# EAGLE design T STorM32 motor v251E-jst (EAGLE 7.5.0)
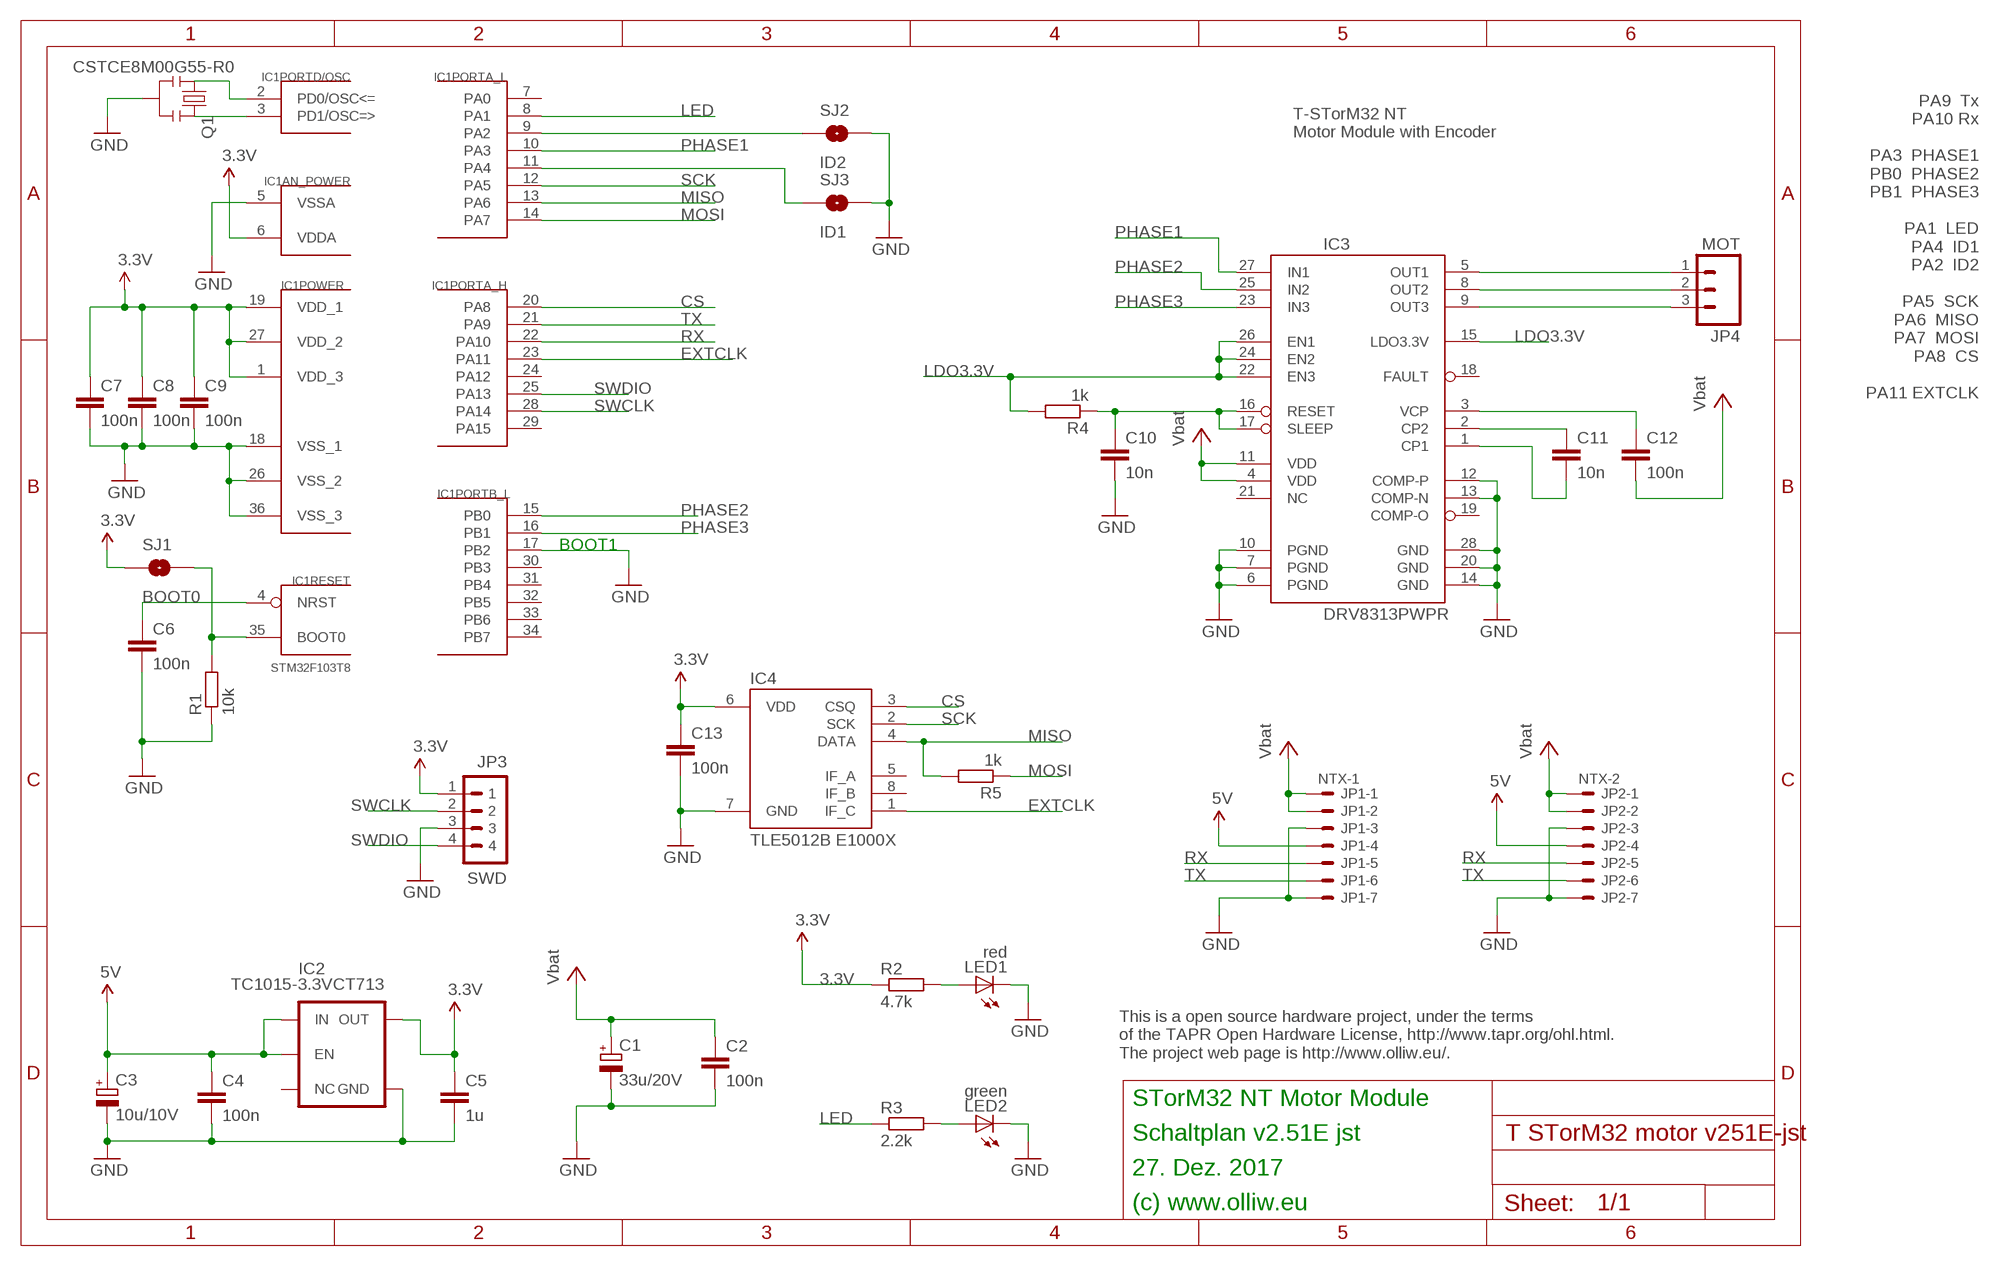
[diagram p0: schematic, sheet 1]

## Parts
C1  33u/20V  CPOL-EUSMCC  [SMC_C]
C2  100n  C-EUC0603  [C0603]
C3  10u/10V  CPOL-EUSMCB  [SMC_B]
C4  100n  C-EUC0603  [C0603]
C5  1u  C-EUC0603  [C0603]
C6  100n  C-EUC0603  [C0603]
C7  100n  C-EUC0603  [C0603]
C8  100n  C-EUC0603  [C0603]
C9  100n  C-EUC0603  [C0603]
C10  10n  C-EUC0603  [C0603]
C11  10n  C-EUC0603  [C0603]
C12  100n  C-EUC0603  [C0603]
C13  100n  C-EUC0603  [C0603]
IC1  STM32F103T8  STM32F10XTXU6  [VFQFPN36]
IC2  TC1015-3.3VCT713  V_REG_TPS76433SOT23-5  [SOT23-5]
IC3  DRV8313PWPR  DRV8313  [HTSSOP28]
IC4  TLE5012B E1000X  TLE5012B  [SO08]
JP1  NTX-1  SM07B-SRSS-TB  [SM07B-SRSS-TB]
JP2  NTX-2  SM07B-SRSS-TB  [SM07B-SRSS-TB]
JP3  SWD  P4X1_1P27-OCT_BILEX  [4X1_1P27_OCT_BILEX]
JP4  MOT  M03PTH  [1X03]
LED1  red  LEDCHIPLED_0603  [CHIPLED_0603]
LED2  green  LEDCHIPLED_0603  [CHIPLED_0603]
Q1  CSTCE8M00G55-R0  RESONATORSMD  [RESONATOR-SMD]
R1  10k  R-EU_R0603  [R0603]
R2  4.7k  R-EU_R0603  [R0603]
R3  2.2k  R-EU_R0603  [R0603]
R4  1k  R-EU_R0603  [R0603]
R5  1k  R-EU_R0603  [R0603]
SJ1  BOOT0  SOLDERJUMPERNO  [SJ_2S-NO]
SJ2  ID2  SOLDERJUMPERNO  [SJ_2S-NO]
SJ3  ID1  SOLDERJUMPERNO  [SJ_2S-NO]

## Nets
3.3V: C5.1 C7.1 C8.1 C9.1 C13.1 IC1.1(POWER:VDD_3) IC1.6(AN_POWER:VDDA) IC1.19(POWER:VDD_1) IC1.27(POWER:VDD_2) IC2.5(OUT) IC4.6(VDD) JP3.1 R2.1 SJ1.1
5V: C3.+ C4.1 IC2.1(IN) IC2.3(EN) JP1.4 JP2.4
CS: IC1.20(PORTA_H:PA8) IC4.3(CSQ)
EXTCLK: IC1.23(PORTA_H:PA11) IC4.1(IF_C)
GND: C1.- C2.2 C3.- C4.2 C5.2 C6.2 C7.2 C8.2 C9.2 C10.2 C13.2 IC1.5(AN_POWER:VSSA) IC1.17(PORTB_L:PB2) IC1.18(POWER:VSS_1) IC1.26(POWER:VSS_2) IC1.36(POWER:VSS_3) IC2.2(GND) IC3.6(PGND) IC3.7(PGND) IC3.10(PGND) IC3.12(COMP-P) IC3.13(COMP-N) IC3.14(GND) IC3.20(GND) IC3.28(GND) IC4.7(GND) JP1.3 JP1.7 JP2.3 JP2.7 JP3.3 LED1.C LED2.C Q1.2 R1.1 SJ2.2 SJ3.2
LDO3.3V: IC3.15(LDO3.3V) IC3.22(EN3) IC3.24(EN2) IC3.26(EN1) R4.2
LED: IC1.8(PORTA_L:PA1) R3.1
MISO: IC1.13(PORTA_L:PA6) IC4.4(DATA) R5.2
MOSI: IC1.14(PORTA_L:PA7) R5.1
N$2: IC3.9(OUT3) JP4.3
N$3: IC1.9(PORTA_L:PA2) SJ2.1
N$4: IC1.11(PORTA_L:PA4) SJ3.1
N$7: C6.1 IC1.4(RESET:NRST)
N$8: IC1.35(RESET:BOOT0) R1.2 SJ1.2
N$9: IC1.2(PORTD/OSC:PD0/OSC<=) Q1.1
N$10: IC1.3(PORTD/OSC:PD1/OSC=>) Q1.3
N$11: LED1.A R2.2
N$12: LED2.A R3.2
N$14: IC3.8(OUT2) JP4.2
N$15: IC3.5(OUT1) JP4.1
N$16: C11.1 IC3.2(CP2)
N$18: C11.2 IC3.1(CP1)
N$19: C10.1 IC3.16(RESET) IC3.17(SLEEP) R4.1
N$20: C12.1 IC3.3(VCP)
PHASE1: IC1.10(PORTA_L:PA3) IC3.27(IN1)
PHASE2: IC1.15(PORTB_L:PB0) IC3.25(IN2)
PHASE3: IC1.16(PORTB_L:PB1) IC3.23(IN3)
RX: IC1.22(PORTA_H:PA10) JP1.5 JP2.5
SCK: IC1.12(PORTA_L:PA5) IC4.2(SCK)
SWCLK: IC1.28(PORTA_H:PA14) JP3.2
SWDIO: IC1.25(PORTA_H:PA13) JP3.4
TX: IC1.21(PORTA_H:PA9) JP1.6 JP2.6
VCC: C1.+ C2.1 C12.2 IC3.4(VDD) IC3.11(VDD) JP1.1 JP1.2 JP2.1 JP2.2 ; supply symbol labelled Vbat
Unconnected: IC1.7(PORTA_L:PA0) IC1.24(PORTA_H:PA12) IC1.29(PORTA_H:PA15) IC1.30(PORTB_L:PB3) IC1.31(PORTB_L:PB4) IC1.32(PORTB_L:PB5) IC1.33(PORTB_L:PB6) IC1.34(PORTB_L:PB7) IC2.4(NC) IC3.18(FAULT) IC3.19(COMP-O) IC3.21(NC) IC4.5(IF_A) IC4.8(IF_B)

## Notes on the sheet
- PA9  Tx
  PA10 Rx
  
  PA3  PHASE1
  PB0  PHASE2
  PB1  PHASE3
  
  PA1  LED
  PA4  ID1
  PA2  ID2
  
  PA5  SCK
  PA6  MISO
  PA7  MOSI
  PA8  CS
  
  PA11 EXTCLK
- T-STorM32 NT
  Motor Module with Encoder
- BOOT1
- This is a open source hardware project, under the terms
  of the TAPR Open Hardware License, http://www.tapr.org/ohl.html.
  The project web page is http://www.olliw.eu/.
- STorM32 NT Motor Module
- Schaltplan v2.51E jst
- 27. Dez. 2017
- (c) www.olliw.eu

## Library data of the parts
C1 C3 = rcl:CPOL-EU: POLARIZED CAPACITOR, European symbol
C2 C4-C13 = rcl:C-EU: CAPACITOR, European symbol
IC1 = # stm32:STM32F10XTXU6: STM32F101/103 36pad VFQPFN36
IC2 = # SparkFun2:V_REG_TPS76433: Voltage Regulator Older TI part. LDO 150mA regulator. No output by-pass cap option. See V_REG_LDO for a better part.
IC3 = # stdlib:DRV8313
IC4 = # stdlib:TLE5012B
JP1 JP2 = con-jst2:?M07B-SRSS-TB: Disconnectable Crimp style connector, 1.0mm pitch 7 contacts
JP3 = # stdlib:P4X1_1P27
JP4 = # SparkFun:M03: Header 3 Standard 3-pin 0.1" header. Use with straight break away headers (SKU : PRT-00116), right angle break away headers (PRT-00553), swiss pins (PRT-00743), machine pins (PRT-00117), and female headers (PRT-00115). Molex polarized connector foot print use with SKU : PRT-08232 with associated crimp pins and housings.
LED1 LED2 = led:LED: LED OSRAM: - CHIPLED LG R971, LG N971, LY N971, LG Q971, LY Q971, LO R971, LY R971 LH N974, LH R974 LS Q976, LO Q976, LY Q976 LO Q996 - Hyper CHIPLED LW Q18S LB Q993, LB Q99A, LB R99A - SideLED LS A670, LO A670, LY A670, LG A670, LP A670 LB A673, LV A673, LT A673, LW A673 LH A674 LY A675 LS A676, LA A676, LO A676, LY A676, LW A676 LS A679, LY A679, LG A679 - Hyper Micro SIDELED® LS Y876, LA Y876, LO Y876, LY Y876 LT Y87S - SmartLED LW L88C, LW L88S LB L89C, LB L89S, LG L890 LS L89K, LO L89K, LY L89K LS L896, LA L896, LO L896, LY L896 - TOPLED LS T670, LO T670, LY T670, LG T670, LP T670 LSG T670, LSP T670, LSY T670, LOP T670, LYG T670 LG T671, LOG T671, LSG T671 LB T673, LV T673, LT T673, LW T673 LH T674 LS T676, LA T676, LO T676, LY T676, LB T676, LH T676, LSB T676, LW T676 LB T67C, LV T67C, LT T67C, LS T67K, LO T67K, LY T67K, LW E67C LS E67B, LA E67B, LO E67B, LY E67B, LB E67C, LV E67C, LT E67C LW T67C LS T679, LY T679, LG T679 LS T770, LO T770, LY T770, LG T770, LP T770 LB T773, LV T773, LT T773, LW T773 LH T774 LS E675, LA E675, LY E675, LS T675 LS T776, LA T776, LO T776, LY T776, LB T776 LHGB T686 LT T68C, LB T68C - Hyper Mini TOPLED® LB M676 - Mini TOPLED Santana® LG M470 LS M47K, LO M47K, LY M47K Source: http://www.osram.convergy.de LUXEON: - LUMILED® LXK2-PW12-R00, LXK2-PW12-S00, LXK2-PW14-U00, LXK2-PW14-V00 LXK2-PM12-R00, LXK2-PM12-S00, LXK2-PM14-U00 LXK2-PE12-Q00, LXK2-PE12-R00, LXK2-PE12-S00, LXK2-PE14-T00, LXK2-PE14-U00 LXK2-PB12-K00, LXK2-PB12-L00, LXK2-PB12-M00, LXK2-PB14-N00, LXK2-PB14-P00, LXK2-PB14-Q00 LXK2-PR12-L00, LXK2-PR12-M00, LXK2-PR14-Q00, LXK2-PR14-R00 LXK2-PD12-Q00, LXK2-PD12-R00, LXK2-PD12-S00 LXK2-PH12-R00, LXK2-PH12-S00 LXK2-PL12-P00, LXK2-PL12-Q00, LXK2-PL12-R00 Source: www.luxeon.com KINGBRIGHT: KA-3528ASYC Source: www.kingbright.com
Q1 = # SparkFun2:RESONATOR: Resonator Small SMD resonator. This is the itty bitty 10/20MHz resonators with built in caps. CSTCE10M0G55 and CSTCE20M0V53. Footprint has been reviewed closely but hasn't been tested yet.
R1-R5 = rcl:R-EU_: RESISTOR, European symbol
SJ1-SJ3 = # SparkFun2:SOLDERJUMPER: Solder Jumper Standard SMD solder jumper. Used to automate production. Two varients : Normally Open and Normally Closed are the same, but have different paste layers. NC will have a large amount of paste and should jumper during reflow.

## Board
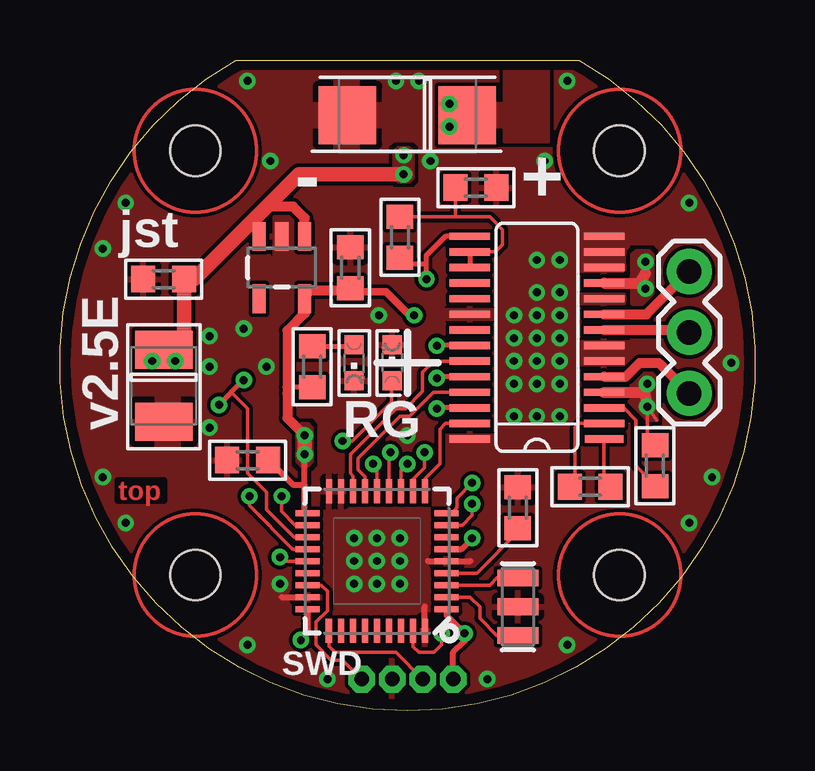
[diagram p1: board, top side]
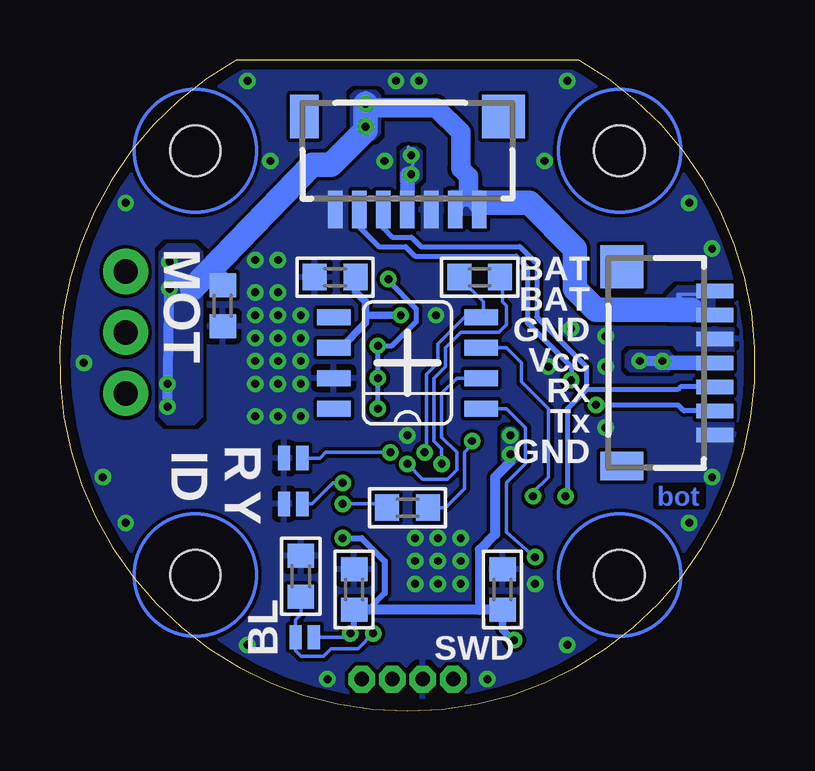
[diagram p2: board, bottom side, seen from below]

Size 28.97 x 27.12 mm. Coordinates in mm from the lower left corner, seen from the top.
Outline: 7.34,27.12 21.63,27.12 arc-301 7.34,27.12
Copper layers (1*16): Top 0.0356mm / dielectric 1.5011mm / Bottom 0.0356mm
Design rules "ow-oshpark-2layer": minimum track width 6mil, minimum drill 13mil, track to track 6mil, track to pad 6mil, pad to pad 6mil, via to via 6mil, smd to smd 6mil, copper to edge 15mil, drill to drill 6mil, minimum pad ring 7mil, minimum via ring 7mil, stop-mask expansion 2.5mil, vias tented up to drill 26mil, thermal gap 10mil
Holes 2.1 mm at 5.65,23.34 23.33,23.34 23.33,5.66 5.65,5.66

### Footprints (pad centres in the part's own frame; a part is rotated, then mirrored left to right if it is on the bottom)
SMC_C = smd 2.4 x 2.4: + -2.5,0; - 2.5,0
C0603 = smd 1 x 1.1: 1 -0.85,0; 2 0.85,0
SMC_B = smd 1.6 x 2.4: + -1.5,0; - 1.5,0
VFQFPN36 = smd 1 x 0.25: 1 -2.9,2; 2 -2.9,1.5; 3 -2.9,1; 4 -2.9,0.5; 5 -2.9,0; 6 -2.9,-0.5; 7 -2.9,-1; 8 -2.9,-1.5; 9 -2.9,-2; 19 2.9,-2; 20 2.9,-1.5; 21 2.9,-1; 22 2.9,-0.5; 23 2.9,0; 24 2.9,0.5; 25 2.9,1; 26 2.9,1.5; 27 2.9,2 | smd 0.25 x 1: 10 -2,-2.9; 11 -1.5,-2.9; 12 -1,-2.9; 13 -0.5,-2.9; 14 0,-2.9; 15 0.5,-2.9; 16 1,-2.9; 17 1.5,-2.9; 18 2,-2.9; 29 1.5,2.9; 30 1,2.9; 31 0.5,2.9; 32 0,2.9; 33 -0.5,2.9; 34 -1,2.9; 35 -1.5,2.9; 36 -2,2.9 | smd 0.27 x 1: 28 2,2.9
SOT23-5 = smd 0.55 x 1.2: 1 -0.95,-1.3; 2 0,-1.3; 3 0.95,-1.3; 4 0.95,1.3; 5 -0.95,1.3
HTSSOP28 = smd 0.3 x 1.6: 1 0,-2.8 | smd 0.305 x 1.676: 2 0.65,-2.8; 3 1.3,-2.8; 4 1.95,-2.8; 5 2.6,-2.8; 6 3.25,-2.8; 7 3.9,-2.8; 8 4.55,-2.8; 9 5.2,-2.8; 10 5.85,-2.8; 11 6.5,-2.8; 12 7.15,-2.8; 13 7.8,-2.8; 14 8.45,-2.8; 15 8.45,2.8; 16 7.8,2.8; 17 7.15,2.8; 18 6.5,2.8; 19 5.85,2.8; 20 5.2,2.8; 21 4.55,2.8; 22 3.9,2.8; 23 3.25,2.8; 24 2.6,2.8; 25 1.95,2.8; 26 1.3,2.8; 27 0.65,2.8; 28 0,2.8
SO08 = smd 0.66 x 1.397: 1 0,-3.073; 2 1.27,-3.073; 3 2.54,-3.073; 4 3.81,-3.073; 5 3.81,3.073; 6 2.54,3.073; 7 1.27,3.073; 8 0,3.073
SM07B-SRSS-TB = smd 0.6 x 1.55: 1 -3,2.975; 2 -2,2.975; 3 -1,2.975; 4 0,2.975; 5 1,2.975; 6 2,2.975; 7 3,2.975 | smd 1.8 x 1.8: FIT@1 -4,-0.9 | smd 1.2 x 1.8: FIT@2 4.3,-0.9
4X1_1P27_OCT_BILEX = drill 0.61 pad 1.118 octagon: 1 0,0; 2 0,-1.27; 3 0,-2.54; 4 0,-3.81
1X03 = drill 1.016 pad 1.88: 1 0,0; 2 2.54,0; 3 5.08,0
CHIPLED_0603 = smd 0.8 x 0.8: A 0,-0.75; C 0,0.75
RESONATOR-SMD = smd 0.7 x 1.7: 1 -1.2,0; 2 0,0; 3 1.2,0
R0603 = smd 1 x 1.1: 1 -0.85,0; 2 0.85,0
SJ_2S-NO = smd 0.508 x 1.016: 1 -0.381,0; 2 0.381,0

### Placement (x,y rotation side)
C1  14.49,24.82 180 top
C2  22.19,16.88 270 bottom
C3  4.33,13.55 270 top
C4  4.33,17.99 180 top
C5  12.11,18.47 90 top
C6  19.09,8.47 90 top
C7  10.52,5.06 90 bottom
C8  7.82,10.45 180 top
C9  16.71,5.06 90 bottom
C10  17.34,21.8 0 top
C11  22.11,9.34 0 top
C12  24.81,10.22 90 top
C13  17.5,18.07 180 bottom
IC1  13.22,6.25 180 top
IC2  9.25,18.47 180 top
IC3  19.88,11.33 90 top
IC4  14.49,12.6 90 bottom
JP1  4.64,14.5 270 bottom
JP2  14.49,23.87 180 bottom
JP3  16.39,1.33 270 top
JP4  26.23,13.23 90 top
LED1  12.26,14.5 180 top
LED2  13.85,14.5 0 top
Q1  19.09,4.34 90 top
R1  18.93,5.61 270 bottom
R2  10.52,14.34 90 top
R3  14.49,8.47 0 bottom
R4  14.17,19.74 270 top
R5  11.47,18.07 180 bottom
SJ1  18.77,3.07 180 bottom
SJ2  19.25,8.63 180 bottom
SJ3  19.25,10.53 180 bottom

### Tracks (layer width: path | path; a pad name or v marks a point on that pad's centre or on a via)
3.3V  (via drill 0.33)
  Top 0.152: IC1.19 10.2,8.25 | 9.38,13.49 9.49,13.23 | C5.1 12.53,17.46 | C8.1 8.51,10.32
  Top 0.203: R2.1 9.38,13.49
  Top 0.254: IC1.27 10.32,3.23 v10.04,2.95 | 10.2,8.25 10.2,9.42 | 10.2,9.42 10.2,10.45 | IC1.6 16.73,6.75 v17.19,7.2 | JP3.1 16.39,2.44 16.87,2.91 v16.87,3.23 16.12,3.98 IC1.1 | C8.1 8.85,10.3 9.72,9.42 10.2,9.42
  Top 0.305: 10.2,10.45 v10.2,10.69 | 12.53,17.46 13.59,17.46 14.57,16.49 v14.77,16.49 | 12.42,17.52 12.37,17.52 C5.1
  Top 0.406: v10.2,11.49 9.49,12.2 9.49,13.23 9.49,15.85 10.2,16.56 IC2.5 10.36,17.52 12.42,17.52
  Top 0.61: v10.2,11.49 v10.2,10.69
  Bottom 0.152: 16.08,4.26 16.71,4.13 | IC4.6 17.27,15.14 | v16.87,3.23 17.03,3.07 SJ1.1
  Bottom 0.254: v17.19,7.2 16.39,7.2 15.44,6.25 15.44,4.9 16.08,4.26 | v16.87,3.23 16.71,3.39 16.71,4.13 C9.1
  Bottom 0.305: v10.04,2.95 10.08,2.95 10.52,3.39 C7.1 | 17.27,15.14 16.23,16.17 16.23,16.57 | v14.77,16.49 16.15,16.49 16.23,16.57 | C13.1 16.65,17.46 16.23,17.04 16.23,16.57
  Bottom 0.406: C7.1 11.47,4.21 | 11.47,4.21 C9.1 | v10.2,10.69 10.2,10.38 10.84,9.74 10.84,7.36 11.47,6.72 11.47,4.21
  pour Top: 9.88,11.8 10.04,11.96 10.36,11.96 10.52,11.8 10.52,10.37 10.36,10.22 10.04,10.22 9.88,10.37
  pour Bottom: 9.88,11.64 10.04,11.8 10.36,11.8 10.52,11.64 10.52,10.45 10.36,10.3 10.04,10.3 9.88,10.45
5V  (via drill 0.33)
  Top 0.152: v14.33,22.36 14.41,22.36 | 4.17,15.53 v3.85,14.58 | IC2.3 8.46,20.06 8.06,20.46
  Top 0.406: IC2.1 10.2,20.54 9.72,21.01 8.61,21.01 | C3.+ 4.02,14.58 v3.85,14.58
  Top 0.61: 14.41,22.36 9.96,22.36 8.61,21.01 8.06,20.46 5.6,18 C4.1 5.18,15.59 v3.85,14.58
  Bottom 0.152: 4.28,14.55 v3.85,14.58 | v14.33,22.36 14.22,23.19 14.44,23.5 v14.33,23.15
  Bottom 0.203: 3.93,14.66 v3.85,14.58 3.93,14.5 | 14.49,22.36 v14.33,22.36
  Bottom 0.406: v4.8,14.58 v3.85,14.58
  Bottom 0.61: JP1.4 3.93,14.5 | JP2.4 14.49,22.36
  pour Bottom: 3.45,14.82 3.61,14.98 5.2,14.98 5.36,14.82 5.36,14.34 5.2,14.18 3.61,14.18 3.45,14.34
  pour Bottom: 13.93,23.31 14.09,23.47 14.57,23.47 14.73,23.31 14.73,22.04 14.57,21.88 14.25,21.88 13.93,22.2
  pour Top: 14.09,22.04 13.93,22.2 13.93,23.31 14.09,23.47 14.57,23.47 14.73,23.31 14.73,22.2 14.57,22.04
CS  (via drill 0.33)
  Top 0.152: IC1.20 9.81,7.75 9.25,8.31 v9.25,8.95
  Bottom 0.152: IC4.3 10.36,15.14 9.72,14.5 9.72,13.71 8.61,12.6 8.61,9.74 9.25,9.1 v9.25,8.95
EXTCLK  (via drill 0.33)
  Top 0.152: IC1.23 9.41,6.25 9.25,6.41 v9.17,6.41
  Bottom 0.152: IC4.1 10.36,12.6 9.57,11.8 9.57,10.3 10.36,9.5 10.36,7.44 v9.17,6.41
GND  (via drill 0.33)
  Top 0.254: 9.25,4.74 10.68,4.74 | 15.2,2.99 15.2,4.34 | 15.36,6.25 17.11,6.25
  other vias: 14.17,5.29 12.26,6.25 18.93,13.63 18.93,15.53 18.93,14.58 13.22,6.25 12.26,7.2 13.22,7.2 14.17,7.2 14.17,6.25 12.26,5.29 13.22,5.29 18.93,16.49 18.93,12.28 7.82,2.75 27.98,14.5 17.82,1.33 21.15,2.75 26.23,7.83 26.23,21.17 21.15,26.25 7.82,26.25 2.74,21.17 2.74,7.83 13.3,16.49 7.66,15.93 14.96,26.25 14.01,26.25 8.77,22.92 20.2,22.92 27.19,9.74 1.79,9.74 1.79,19.26 19.88,18.79 19.88,17.44 19.88,16.49 19.88,15.53 19.88,14.58 19.88,13.63 19.88,12.28 20.84,18.79 20.84,17.44 20.84,16.49 20.84,15.53 20.84,14.58 20.84,13.63 20.84,12.28 8.61,14.34 15.44,22.92 11.15,1.33 6.23,14.34 6.23,15.61 14.49,11.49 6.23,11.8 9.17,5.29
  pour Top (isolate 0.152, rank 6): 14.49,28.47 arc90 0.52,14.5 arc90 14.49,0.53 arc90 28.46,14.5 arc90
  pour Bottom (isolate 0.152, rank 6): 14.49,28.47 arc-90 28.46,14.5 arc-90 14.49,0.53 arc-90 0.52,14.5 arc-90
  pour Top (no thermals): 4.96,13.39 4.96,10.61 4.01,10.61 4.01,13.39
  pour Top (no thermals): 12.42,26.41 12.42,23.23 11.47,23.23 11.47,26.41
  pour Top (no thermals): 13.53,24.34 10.36,24.34 10.36,25.3 13.53,25.3
  pour Top (no thermals): 23.54,18.39 23.46,18.31 21.31,18.31 21.31,20.22 23.69,20.22 23.69,19.34 23.54,19.19
  pour Top (no thermals): 23.85,14.42 21.31,14.42 21.31,15.38 23.85,15.38
  pour Top (no thermals): 23.54,16.96 21.47,16.96 21.47,17.36 23.54,17.36
  pour Top (no thermals): 10.2,20.85 10.2,18.95 8.93,18.95 8.93,20.85
  pour Top (no thermals): 18.3,16.33 15.92,16.33 15.92,16.72 18.3,16.72
  pour Top (no thermals): 18.3,10.93 15.92,10.93 15.92,11.49 18.3,11.49
  pour Bottom (no thermals): 0.99,11.01 3.06,11.01 3.06,15.93 0.91,15.93 0.91,11.25
  pour Bottom (no thermals): 17.98,19.9 17.98,22.12 16.71,22.12 16.71,19.9
  pour Bottom (no thermals): 13.85,19.9 13.85,21.8 13.53,22.12 13.06,22.12 13.06,19.9
LDO3.3V  (via drill 0.33)
  Top 0.152: 15.75,12.63 v15.72,12.6
  Top 0.203: IC3.24 15.82,13.93 v15.72,13.87 | IC3.22 15.79,15.23 v15.72,15.22 | IC3.26 15.75,12.63 | IC3.15 16.07,19.78 15.28,18.99 15.28,18.63 | v15.28,18 15.28,18.63 | R4.2 14.17,18.79 14.33,18.63 15.28,18.63
  Bottom 0.203: v15.72,12.6 v15.72,13.87 v15.72,15.22 15.12,15.22 14.13,16.21 14.13,16.76 15.28,17.92 v15.28,18
LED  (via drill 0.33)
  Top 0.152: IC1.8 16.78,7.75 17.19,8.15 v17.19,8.63
  Bottom 0.152: R3.1 15.34,8.53 15.44,8.63 v17.19,8.63
MISO  (via drill 0.33)
  Top 0.152: IC1.13 13.72,10.72 v13.77,10.77
  Bottom 0.152: v13.77,10.77 13.69,10.93 13.69,14.03 13.22,14.5 13.22,15.3 12.11,16.41 11.95,16.41 | 11.95,16.41 IC4.4 | R5.2 12.32,18.05 11.31,17.04 11.31,16.57 11.95,16.41
MOSI  (via drill 0.33)
  Top 0.152: IC1.14 13.22,10.14 v13.06,10.3
  Bottom 0.152: R5.1 10.52,17.73 10.52,17.04 10.36,16.88 10.36,16.09 10.68,15.77 12.27,15.77 12.9,15.14 12.9,14.34 13.38,13.87 13.38,11.25 13.06,10.93 v13.06,10.3
N$2
  Top 0.406: IC3.9 24.37,16.53 24.45,16.53 JP4.3
N$3  (via drill 0.33)
  Top 0.152: IC1.9 16.33,8.25 16.55,8.47 16.55,8.87 v17.19,9.5
  Bottom 0.152: v17.19,9.5 17.58,9.5 18.46,8.63 SJ2.1
N$4  (via drill 0.33)
  Top 0.152: IC1.11 14.72,9.65 15.2,10.14 v15.2,10.77
  Bottom 0.152: SJ3.1 18.14,10.53 17.9,10.77 v15.2,10.77
N$7
  Top 0.152: IC1.4 17.38,5.75 19.09,7.46 C6.1
N$8  (via drill 0.33)
  Top 0.152: IC1.35 14.72,2.68 14.96,2.44 15.6,2.44 15.92,2.76 v15.92,3.23
  Bottom 0.152: R1.2 18.93,4.03 19.15,3.8 SJ1.2 19.15,2.5 18.93,2.28 17.98,2.28 17.66,2.6 16.55,2.6 v15.92,3.23
N$9
  Top 0.152: IC1.2 17.1,4.75 17.5,4.34 17.5,3.87 18.23,3.14 Q1.1
N$10
  Top 0.152: IC1.3 17.93,5.25 18.23,5.54 Q1.3
N$11
  Top 0.152: 12.21,15.19 LED1.A
  Top 0.203: R2.2 12.21,15.19
N$12  (via drill 0.33)
  Top 0.152: v11.79,11.25 12.19,11.25 13.82,12.88 13.82,13.75 LED2.A
  Bottom 0.152: v11.79,11.25 11.79,11.09 12.11,10.77 12.11,9.26 12.9,8.47 R3.2
N$14
  Top 0.406: IC3.8 26.18,15.88 JP4.2
N$15
  Top 0.406: IC3.5 23.6,13.93 24.17,14.5 24.97,14.5 JP4.1
N$16
  Top 0.152: IC3.2 21.65,11.98 21.47,11.8 21.47,9.64 C11.1
N$18
  Top 0.152: IC3.1 22.69,9.69 C11.2
N$19
  Top 0.152: IC3.16 18.16,19.13 18.46,19.42 18.46,20.06 17.92,20.59 16.55,20.59 | R4.1 16.55,20.59 | C10.1 16.49,20.65 16.55,20.59
  Top 0.203: IC3.16 IC3.17
N$20
  Top 0.152: IC3.3 23.51,12.63 24.01,12.12 24.01,10.22 24.49,9.74 24.91,9.42 C12.1
PHASE1
  Top 0.152: IC3.27 16.08,11.98 15.84,11.74 15.84,10.3 15.22,9.68 IC1.10
PHASE2
  Top 0.152: IC3.25 15.56,13.28 14.57,12.28 14.17,12.28 12.42,10.53 12.42,10.06 12.72,9.76 IC1.15
PHASE3
  Top 0.152: IC3.23 15.59,14.58 15.12,14.11 15.12,13.31 14.41,12.6 14.01,12.6 12.11,10.69 12.11,9.9 12.22,9.79 IC1.16
RX  (via drill 0.33)
  Top 0.152: IC1.22 9.7,6.75 7.9,8.55 v7.9,8.95
  Bottom 0.203: 7.03,13.39 7.82,12.6 7.82,9.03 v7.9,8.95 | 7.03,13.39 7.03,14.34 9.09,16.41 9.09,18.63 9.8,19.34 13.93,19.34 14.33,19.74 15.12,19.74 15.49,20.11 JP2.5 | JP1.5 3.1,13.5 3.22,13.39 7.03,13.39
SCK  (via drill 0.33)
  Top 0.152: IC1.12 14.22,10.03 v14.49,10.3
  Bottom 0.152: IC4.2 12.42,13.87 13.06,13.23 13.06,11.41 12.42,10.77 12.42,10.06 12.82,9.66 13.85,9.66 v14.49,10.3
SWCLK
  Top 0.152: IC1.28 11.22,2.69 11.47,2.44 14.01,2.44 JP3.2
SWDIO
  Top 0.152: JP3.4 11.79,2.12 11.31,2.12 10.68,2.76 10.68,3.71 11.15,4.18 11.15,4.98 10.88,5.25 IC1.25
TX  (via drill 0.33)
  Top 0.152: IC1.21 9.76,7.25 8.61,8.39 8.61,9.1 7.82,9.9 7.82,12.6 7.15,13.27
  Top 0.203: v7.66,13.79 7.15,13.27 v6.63,12.76
  Bottom 0.203: v6.63,12.76 3.22,12.76 2.96,12.5 JP1.6 | v7.66,13.79 7.66,14.34 9.49,16.17 9.49,18.47 9.96,18.95 14.17,18.95 14.57,19.34 15.68,19.34 16.49,20.15 JP2.6
VCC  (via drill 0.33)
  Top 0.152: 24.89,12.12 v24.49,12.68 | 24.25,12.76 v24.49,12.68 | C12.2 24.75,11.07 24.49,11.33 v24.49,12.68 | v16.23,24.34 16.99,25.02 C1.+
  Top 0.457: IC3.11 24.16,17.83 24.41,18.23 | IC3.4 24.36,13.28 v24.49,12.68
  Bottom 0.152: 3.22,17.36 2.26,17.36 2.1,17.68 1.85,17.68 JP1.1 | 2.66,16.72 3.22,16.72 3.22,17.36 | 2.66,16.72 1.89,16.72 JP1.2 | 2.66,16.72 3.22,17.36 | 22.61,18.15 23.46,17.6
  Bottom 0.305: 11.95,21.41 11.47,21.17
  Bottom 0.406: v24.49,12.68 24.41,18.23 23.46,17.6 | JP2.1 11.49,21.34 11.47,21.17 | JP2.2 12.01,21.39 | 16.23,25.14 v16.23,25.3 16.23,25.61
  Bottom 0.813: 16.23,24.5 16.23,25.14 13.3,25.14 12.27,24.11 12.27,22.6 11.95,22.28 11.95,21.41
  Bottom 1.016: 11.47,21.17 9.41,21.17 7.5,19.27 7.5,17.6 6.63,16.72 2.66,16.72 | 23.46,17.6 18.46,22.76 17.66,22.76 16.23,24.19 16.23,24.5 v16.23,25.3 | C2.1 22.61,18.15
  other vias: 24.41,18.71 24.49,13.63 24.41,17.6
  pour Bottom: 23.06,19.11 23.06,12.28 23.38,11.96 24.49,11.96 24.81,12.28 24.81,19.11 24.49,19.42 23.38,19.42
  pour Top: 23.38,13.55 23.85,13.55 24.41,14.11 24.65,14.11 24.89,13.87 24.89,12.12 24.49,12.12 23.62,12.99 23.38,12.99
  pour Top: 23.38,17.99 23.38,17.76 23.69,17.76 23.85,17.6 23.85,16.96 23.93,16.88 24.25,16.88 24.73,17.36 24.73,19.03 24.57,19.19 24.01,19.19 23.85,19.03 23.85,18.15 23.69,17.99
  pour Bottom (no thermals): 1.71,17.68 3.22,17.68 3.61,17.28 3.61,16.33 3.53,16.25 1.71,16.25
  pour Bottom (no thermals): 11.39,20.69 11.39,21.57 11.47,21.65 12.66,21.65 12.74,21.57 12.74,20.69
  pour Top (no thermals): 18.54,26.81 18.54,25.3 18.06,25.3 18.06,24.34 18.54,24.34 18.54,23.71 20.36,23.71 20.36,26.81
  pour Bottom (no thermals): 15.68,24.11 15.68,25.61 15.84,25.77 16.63,25.77 16.79,25.61 16.79,23.87 15.92,23.87
(copper drawn outside any net)
  shapes: Bottom circle x4, Top circle x4

### Text on the board
Top: top
Bottom: bot
tNames: - | + | jst | v2.5E | R | G | SWD
bNames: BAT | MOT | BAT | GND | Vcc | Rx | Tx | GND | R | ID | Y | SWD | BL